# EAGLE design BSPD_revD (EAGLE 9.2.0)
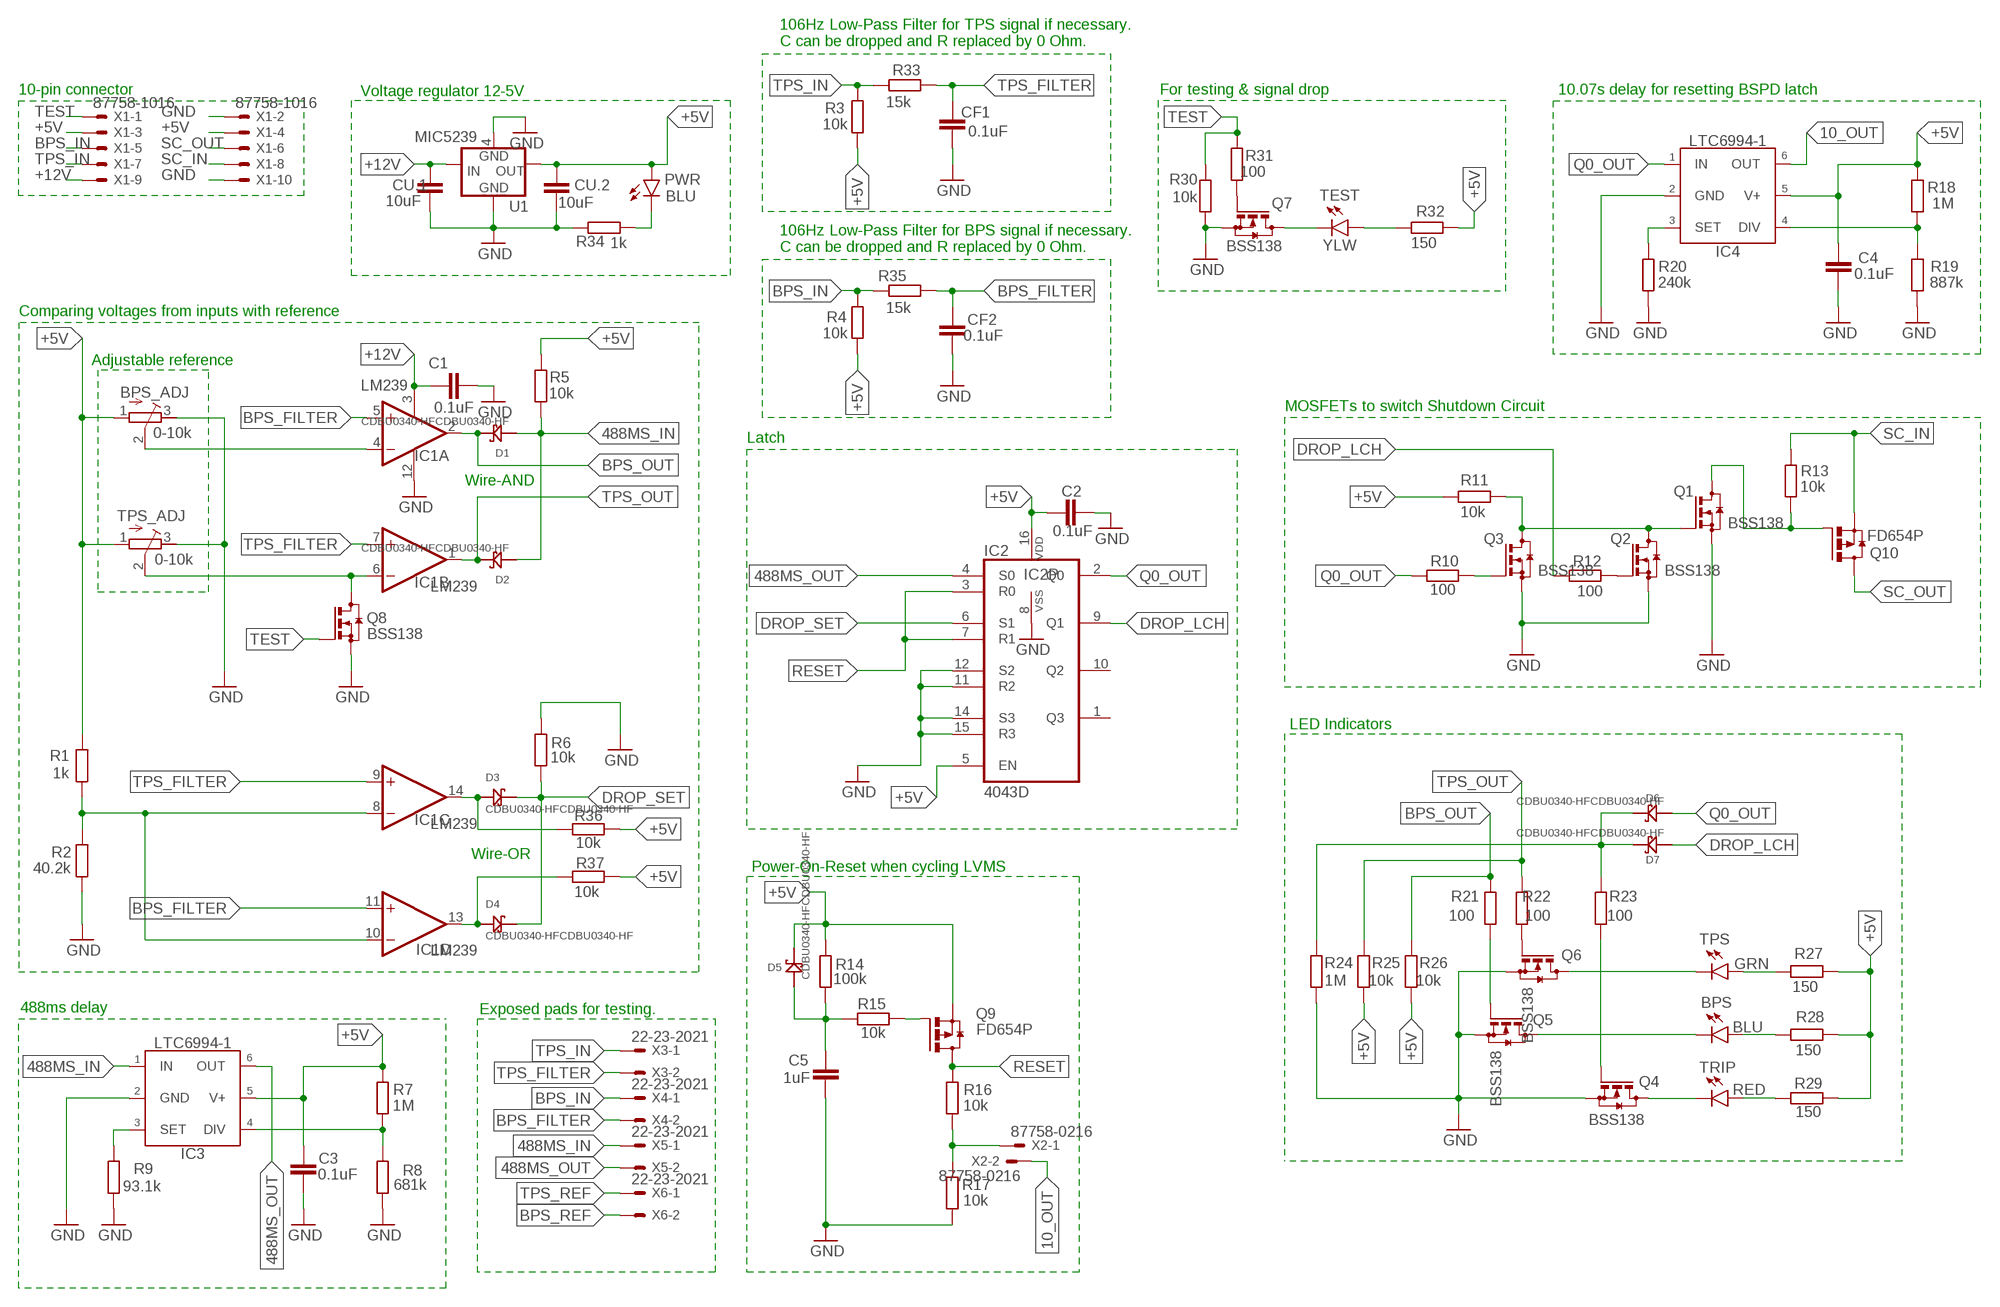
[diagram p0: schematic, sheet 1]

## Parts
BPS  BLU  LEDSML1206  [SML1206]
BPS_ADJ  0-10k  R-TRIMM3296W  [RTRIM3296W]
C1  0.1uF  C-EUC0603  [C0603]
C2  0.1uF  C-EUC0603  [C0603]
C3  0.1uF  C-EUC0603  [C0603]
C4  0.1uF  C-EUC0603  [C0603]
C5  1uF  C-EUC0603  [C0603]
CF1  0.1uF  C-EUC0603  [C0603]
CF2  0.1uF  C-EUC0603  [C0603]
CU.1  10uF  C-EUC0603  [C0603]
CU.2  10uF  C-EUC0603  [C0603]
D1  CDBU0340-HFCDBU0340-HF  [DIOM1709X85]
D2  CDBU0340-HFCDBU0340-HF  [DIOM1709X85]
D3  CDBU0340-HFCDBU0340-HF  [DIOM1709X85]
D4  CDBU0340-HFCDBU0340-HF  [DIOM1709X85]
D5  CDBU0340-HFCDBU0340-HF  [DIOM1709X85]
D6  CDBU0340-HFCDBU0340-HF  [DIOM1709X85]
D7  CDBU0340-HFCDBU0340-HF  [DIOM1709X85]
IC1  LM239  LM2901D  [SO14]
IC2  4043D  [SO16]
IC3  LTC6994-1  [TSOT23-6]
IC4  LTC6994-1  [TSOT23-6]
PWR  BLU  LEDSML1206  [SML1206]
Q1  BSS138  BSS123  [SOT23]
Q2  BSS138  BSS123  [SOT23]
Q3  BSS138  BSS123  [SOT23]
Q4  BSS138  BSS123  [SOT23]
Q5  BSS138  BSS123  [SOT23]
Q6  BSS138  BSS123  [SOT23]
Q7  BSS138  BSS123  [SOT23]
Q8  BSS138  BSS123  [SOT23]
Q9  FD654P  [SOT-23-6]
Q10  FD654P  [SOT-23-6]
R1  1k  R-EU_R0603  [R0603]
R2  40.2k  R-EU_R0603  [R0603]
R3  10k  R-EU_R0603  [R0603]
R4  10k  R-EU_R0603  [R0603]
R5  10k  R-EU_R0603  [R0603]
R6  10k  R-EU_R0603  [R0603]
R7  1M  R-EU_R0603  [R0603]
R8  681k  R-EU_R0603  [R0603]
R9  93.1k  R-EU_R0603  [R0603]
R10  100  R-EU_R0603  [R0603]
R11  10k  R-EU_R0603  [R0603]
R12  100  R-EU_R0603  [R0603]
R13  10k  R-EU_R0603  [R0603]
R14  100k  R-EU_R0603  [R0603]
R15  10k  R-EU_R0603  [R0603]
R16  10k  R-EU_R0603  [R0603]
R17  10k  R-EU_R0603  [R0603]
R18  1M  R-EU_R0603  [R0603]
R19  887k  R-EU_R0603  [R0603]
R20  240k  R-EU_R0603  [R0603]
R21  100  R-EU_R0603  [R0603]
R22  100  R-EU_R0603  [R0603]
R23  100  R-EU_R0603  [R0603]
R24  1M  R-EU_R0603  [R0603]
R25  10k  R-EU_R0603  [R0603]
R26  10k  R-EU_R0603  [R0603]
R27  150  R-EU_R0603  [R0603]
R28  150  R-EU_R0603  [R0603]
R29  150  R-EU_R0603  [R0603]
R30  10k  R-EU_R0603  [R0603]
R31  100  R-EU_R0603  [R0603]
R32  150  R-EU_R0603  [R0603]
R33  15k  R-EU_R0603  [R0603]
R34  1k  R-EU_R0603  [R0603]
R35  15k  R-EU_R0603  [R0603]
R36  10k  R-EU_R0603  [R0603]
R37  10k  R-EU_R0603  [R0603]
TEST  YLW  LEDSML1206  [SML1206]
TPS  GRN  LEDSML1206  [SML1206]
TPS_ADJ  0-10k  R-TRIMM3296W  [RTRIM3296W]
TRIP  RED  LEDSML1206  [SML1206]
U1  MIC5239  [SOT223]
X1  87758-1016  [87758-1016]
X2  87758-0216  [87758-0216]
X3  22-23-2021  [22-23-2021]
X4  22-23-2021  [22-23-2021]
X5  22-23-2021  [22-23-2021]
X6  22-23-2021  [22-23-2021]

## Nets
10_OUT: IC4.6(OUT) X2.2
488MS_IN: D1.2$A(A) D2.2$A(A) IC3.1(IN) R5.1 X5.1
488MS_OUT [Min]: IC2.4(S0) IC3.6(OUT) X5.2
+5V: BPS_ADJ.1(A) C2.1 C3.2 C4.2 CU.2.1 D5.1$K(K) IC2.5(EN) IC2.16(VDD) IC3.5(V+) IC4.5(V+) PWR.A Q9.4(S) R1.2 R3.1 R4.1 R5.2 R7.2 R11.2 R14.2 R18.2 R25.1 R26.1 R27.2 R28.2 R29.2 R32.2 R36.1 R37.1 TPS_ADJ.1(A) U1.3(OUT) X1.3 X1.4
+12V: C1.1 CU.1.1 IC1.3(P:V+) U1.1(IN) X1.9
BPS_DROP: D4.2$A(A) IC1.13(D:OUT) R37.2
BPS_FILTER: CF2.2 IC1.5(A:+IN) IC1.11(D:+IN) R35.1 X4.2
BPS_IN: R4.2 R35.2 X1.5 X4.1
BPS_OUT: D1.1$K(K) IC1.2(A:OUT) R21.2 R26.2
BPS_REF: BPS_ADJ.2(S) IC1.4(A:-IN) X6.2
DROP_LCH: D7.2$A(A) IC2.9(Q1) R12.2
DROP_SET: D3.1$K(K) D4.1$K(K) IC2.6(S1) R6.1
GND: BPS_ADJ.3(E) C1.2 C2.2 C3.1 C4.1 C5.1 CF1.1 CF2.1 CU.1.2 CU.2.2 IC1.12(P:V-) IC2.8(VSS) IC2.11(R2) IC2.12(S2) IC2.14(S3) IC2.15(R3) IC3.2(GND) IC4.2(GND) Q1.2(S) Q2.2(S) Q3.2(S) Q4.2(S) Q5.2(S) Q6.2(S) Q7.2(S) Q8.2(S) R2.1 R6.2 R8.1 R9.1 R17.2 R19.1 R20.1 R24.1 R30.1 R34.1 TPS_ADJ.3(E) U1.2(GND) U1.4(GND_TAB) X1.2 X1.10
LED_DROP: Q7.3(D) TEST.C
N$1: R16.2 R17.1 X2.1
N$2: Q1.3(D) Q10.3(G) R13.2
N$5: IC1.8(C:-IN) IC1.10(D:-IN) R1.1 R2.2
N$9: IC3.4(DIV) R7.1 R8.2
N$10: Q1.1(G) Q2.3(D) Q3.3(D) R11.1
N$11: R27.1 TPS.A
N$12: BPS.A R28.1
N$13: BPS.C Q5.3(D)
N$14: Q6.3(D) TPS.C
N$15: R29.1 TRIP.A
N$16: Q4.3(D) TRIP.C
N$17: Q2.1(G) R12.1
N$18: C5.2 D5.2$A(A) R14.1 R15.2
N$19: PWR.C R34.2
N$24: Q5.1(G) R21.1
N$25: Q6.1(G) R22.1
N$27: Q4.1(G) R23.1
N$28: R32.1 TEST.A
N$31: IC4.4(DIV) R18.1 R19.2
N$32: IC4.3(SET) R20.2
N$33: Q3.1(G) R10.2
N$36: Q7.1(G) R31.1
N$38: IC3.3(SET) R9.2
N$40: D6.1$K(K) D7.1$K(K) R23.2 R24.2
N$41: Q9.3(G) R15.1
Q0_OUT: D6.2$A(A) IC2.2(Q0) IC4.1(IN) R10.1
RESET: IC2.3(R0) IC2.7(R1) Q9.1(D) Q9.2(D) Q9.5(D) Q9.6(D) R16.1
SC_IN: Q10.4(S) R13.1 X1.8
SC_OUT: Q10.1(D) Q10.2(D) Q10.5(D) Q10.6(D) X1.6
TEST: Q8.1(G) R30.2 R31.2 X1.1
TPS_DROP: D3.2$A(A) IC1.14(C:OUT) R36.2
TPS_FILTER: CF1.2 IC1.7(B:+IN) IC1.9(C:+IN) R33.1 X3.2
TPS_IN: R3.2 R33.2 X1.7 X3.1
TPS_OUT: D2.1$K(K) IC1.1(B:OUT) R22.2 R25.2
TPS_REF: IC1.6(B:-IN) Q8.3(D) TPS_ADJ.2(S) X6.1
Unconnected: IC2.1(Q3) IC2.10(Q2)

## Notes on the sheet
- 106Hz Low-Pass Filter for TPS signal if necessary.
  C can be dropped and R replaced by 0 Ohm.
- 10-pin connector | Voltage regulator 12-5V | For testing & signal drop | 10.07s delay for resetting BSPD latch
- 106Hz Low-Pass Filter for BPS signal if necessary.
  C can be dropped and R replaced by 0 Ohm.
- Comparing voltages from inputs with reference
- Adjustable reference
- MOSFETs to switch Shutdown Circuit
- Latch
- Wire-AND
- LED Indicators
- Wire-OR
- Power-On-Reset when cycling LVMS
- 488ms delay | Exposed pads for testing.

## Library data of the parts
BPS PWR TEST TPS TRIP = led:LED: LED OSRAM: - CHIPLED LG R971, LG N971, LY N971, LG Q971, LY Q971, LO R971, LY R971 LH N974, LH R974 LS Q976, LO Q976, LY Q976 LO Q996 - Hyper CHIPLED LW Q18S LB Q993, LB Q99A, LB R99A - SideLED LS A670, LO A670, LY A670, LG A670, LP A670 LB A673, LV A673, LT A673, LW A673 LH A674 LY A675 LS A676, LA A676, LO A676, LY A676, LW A676 LS A679, LY A679, LG A679 - Hyper Micro SIDELED® LS Y876, LA Y876, LO Y876, LY Y876 LT Y87S - SmartLED LW L88C, LW L88S LB L89C, LB L89S, LG L890 LS L89K, LO L89K, LY L89K LS L896, LA L896, LO L896, LY L896 - TOPLED LS T670, LO T670, LY T670, LG T670, LP T670 LSG T670, LSP T670, LSY T670, LOP T670, LYG T670 LG T671, LOG T671, LSG T671 LB T673, LV T673, LT T673, LW T673 LH T674 LS T676, LA T676, LO T676, LY T676, LB T676, LH T676, LSB T676, LW T676 LB T67C, LV T67C, LT T67C, LS T67K, LO T67K, LY T67K, LW E67C LS E67B, LA E67B, LO E67B, LY E67B, LB E67C, LV E67C, LT E67C LW T67C LS T679, LY T679, LG T679 LS T770, LO T770, LY T770, LG T770, LP T770 LB T773, LV T773, LT T773, LW T773 LH T774 LS E675, LA E675, LY E675, LS T675 LS T776, LA T776, LO T776, LY T776, LB T776 LHGB T686 LT T68C, LB T68C - Hyper Mini TOPLED® LB M676 - Mini TOPLED Santana® LG M470 LS M47K, LO M47K, LY M47K Source: http://www.osram.convergy.de LUXEON: - LUMILED® LXK2-PW12-R00, LXK2-PW12-S00, LXK2-PW14-U00, LXK2-PW14-V00 LXK2-PM12-R00, LXK2-PM12-S00, LXK2-PM14-U00 LXK2-PE12-Q00, LXK2-PE12-R00, LXK2-PE12-S00, LXK2-PE14-T00, LXK2-PE14-U00 LXK2-PB12-K00, LXK2-PB12-L00, LXK2-PB12-M00, LXK2-PB14-N00, LXK2-PB14-P00, LXK2-PB14-Q00 LXK2-PR12-L00, LXK2-PR12-M00, LXK2-PR14-Q00, LXK2-PR14-R00 LXK2-PD12-Q00, LXK2-PD12-R00, LXK2-PD12-S00 LXK2-PH12-R00, LXK2-PH12-S00 LXK2-PL12-P00, LXK2-PL12-Q00, LXK2-PL12-R00 Source: www.luxeon.com KINGBRIGHT: KA-3528ASYC Source: www.kingbright.com
BPS_ADJ TPS_ADJ = rcl:R-TRIMM: Trimm resistor; SPICEMODEL: X; SPICEPREFIXL: POT
C1-C5 CF1 CF2 CU.1 CU.2 = rcl:C-EU: CAPACITOR, European symbol; SPICEPREFIX: C
D1-D7 = BSPD:CDBU0340-HF
IC1 = linear:LM2901: COMPARATOR
IC2 = 40xx:4043: Quad 3-state NOR R/S LATCH
IC3 IC4 = div1:LTC6994-1: TimerBlox Retriggerable One Edge Delay; SPICEMODEL: LTC6994-1.sub; VALUE2: LTC6994-1
Q1-Q8 = transistor-small-signal:BSS123: N-CHANNEL MOS FET
Q9 Q10 = BSPD:FD654P
R1-R37 = rcl:R-EU_: RESISTOR, European symbol; SPICEPREFIX: R
U1 = BSPD:MIC5239
X1 = con-molex:87758-1016: 10 Pin - 2mm Dual Row Single Wafer, Vertical T/H HDR Source: http://www.molex.com/pdm_docs/sd/877580616_sd.pdf; MF: MOLEX; MPN: 87758-1016; OC_FARNELL: 7472340; OC_NEWARK: 59J1558
X2 = con-molex:87758-0216: 2 Pin - 2mm Dual Row Single Wafer, Vertical T/H HDR Source: http://www.molex.com/pdm_docs/sd/877580616_sd.pdf; MF: MOLEX; MPN: 87758-0216; OC_FARNELL: unknown; OC_NEWARK: 94M1513
X3-X6 = con-molex:22-23-2021: .100" (2.54mm) Center Header - 2 Pin; MF: MOLEX; MPN: 22-23-2021; OC_FARNELL: 1462926; OC_NEWARK: 25C3832

## Net classes
0 default: width 0.381 mm, drill 0.254 mm, clearance 0.127 mm
1 PWR: width 0.762 mm, drill 0.254 mm, clearance 0.127 mm
2 GND: width 0.762 mm, drill 0.254 mm, clearance 0.127 mm
3 Min: width 0.152 mm, drill 0.254 mm, clearance 0.127 mm

## Board
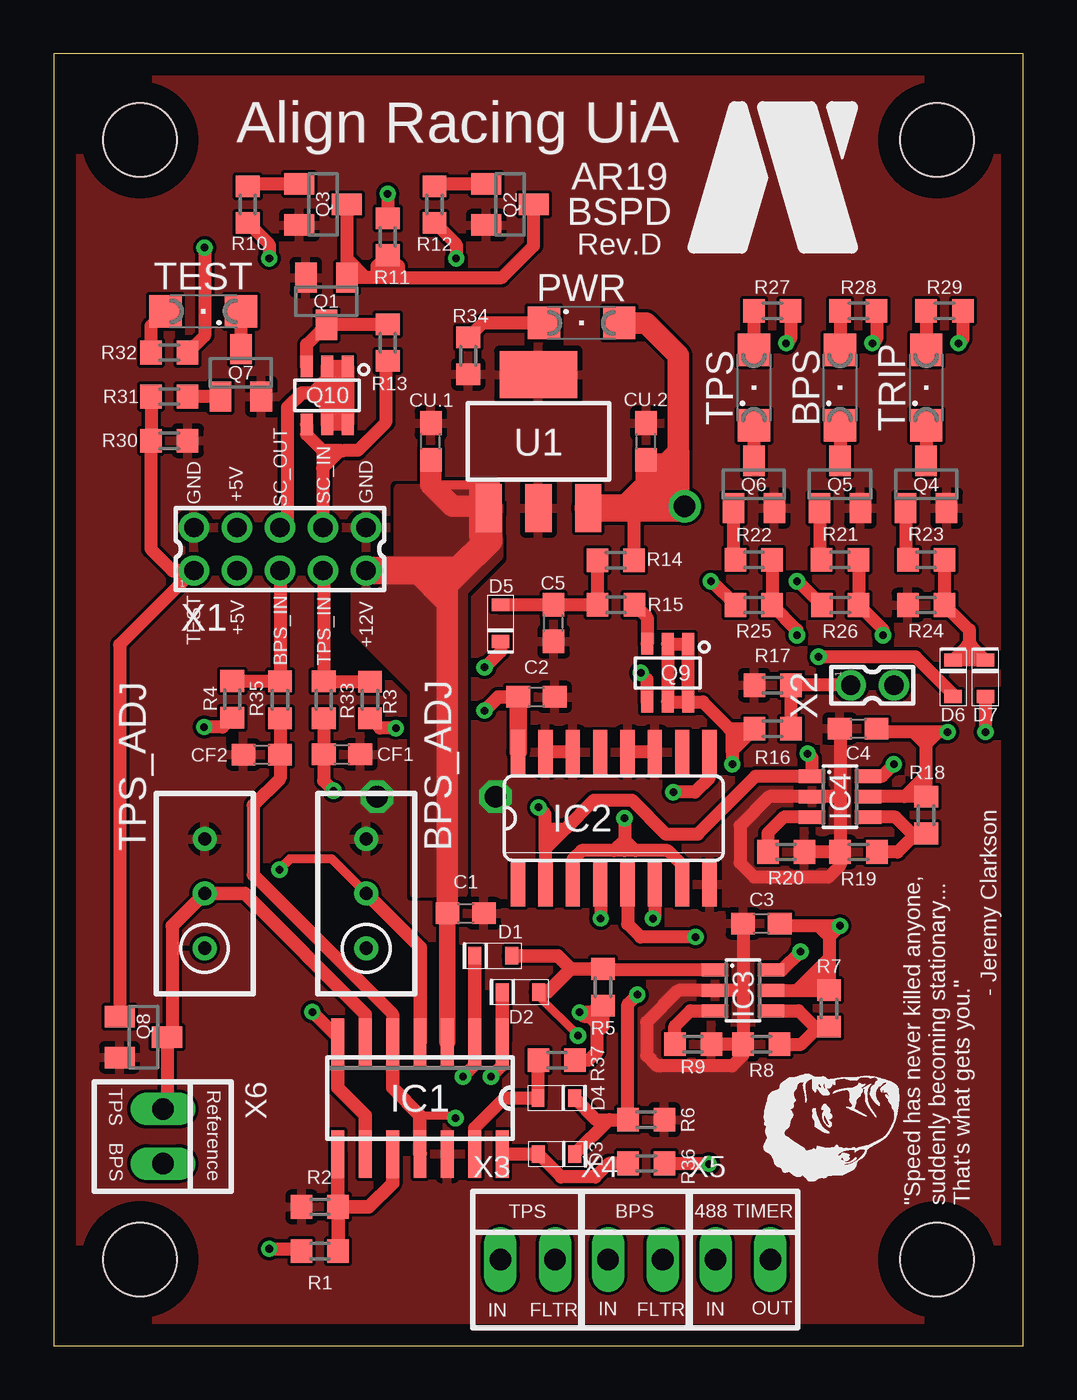
[diagram p1: board, top side]
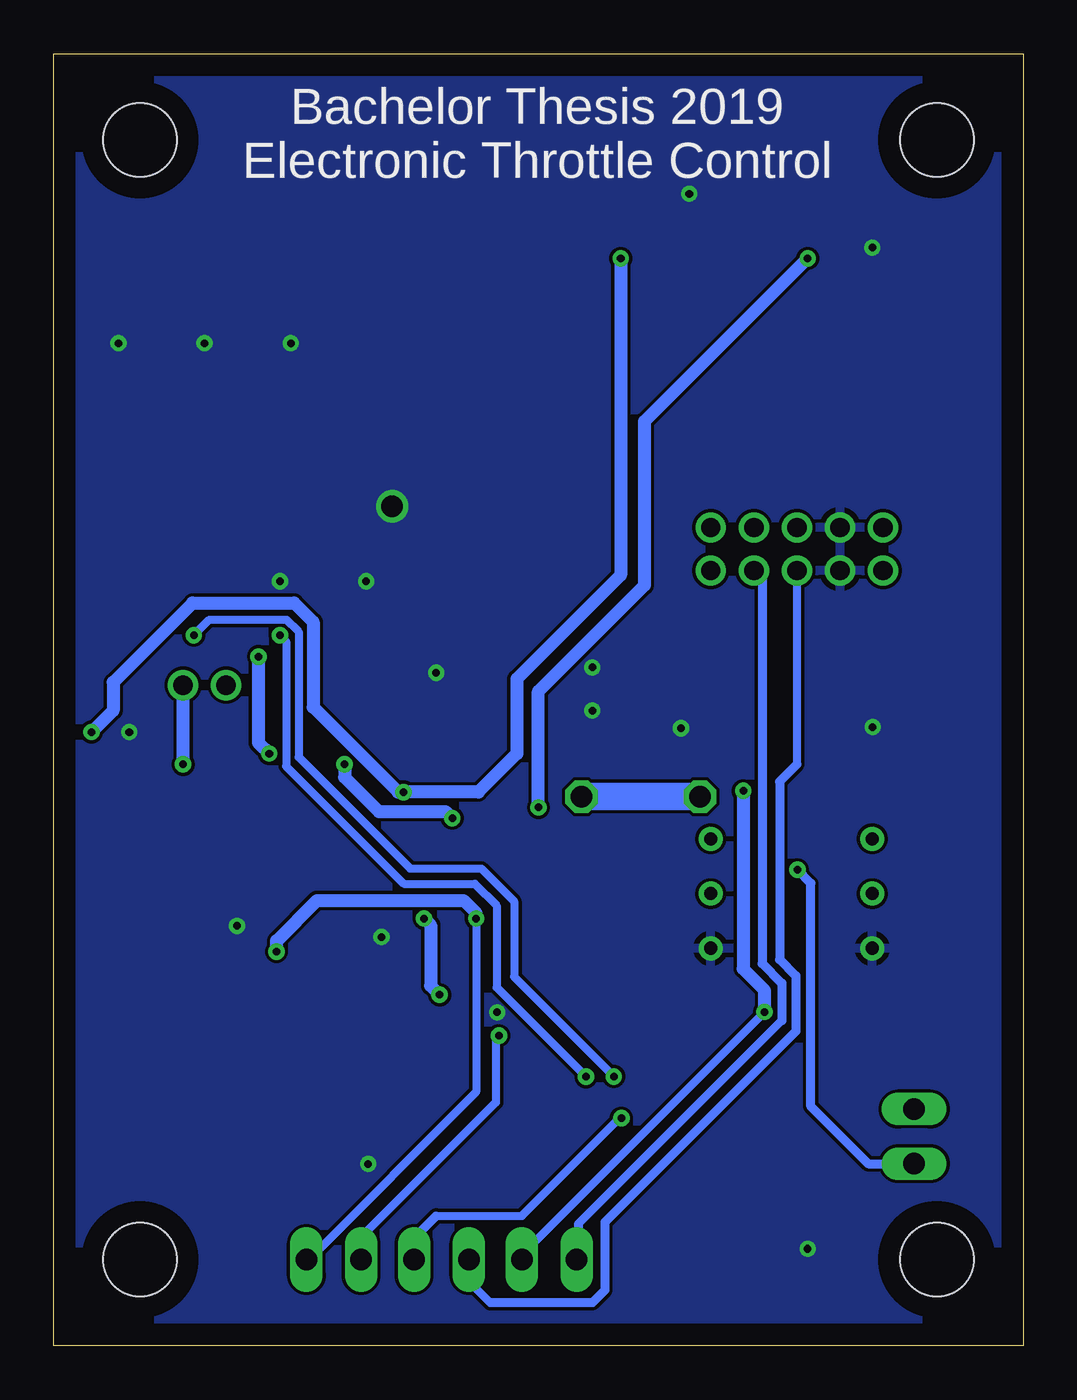
[diagram p2: board, bottom side, seen from below]

Size 45 x 60 mm. Coordinates in mm from the lower left corner, seen from the top.
Outline: 0,0 45,0 45,60 0,60 0,0
Copper layers (1*16): Top 0.035mm / dielectric 1.5mm / Bottom 0.035mm
Design rules "default": minimum track width 6mil, minimum drill 0.35mm, track to track 6mil, track to pad 6mil, pad to pad 6mil, via to via 6mil, smd to smd 6mil, copper to edge 40mil, drill to drill 6mil, minimum pad ring 10mil, minimum via ring 8mil, stop-mask expansion 4mil, vias tented up to drill 0mil, thermal gap 10mil
Holes 3.4 mm at 4,4 4,56 41,56 41,4

### Footprints (pad centres in the part's own frame; a part is rotated, then mirrored left to right if it is on the bottom)
SML1206 = smd 1.5 x 1.5: A 1.75,0; C -1.75,0
RTRIM3296W = drill 0.61: 1 0,-2.54; 2 0,0; 3 0,2.54
C0603 = smd 1.1 x 1: 1 -0.85,0; 2 0.85,0
DIOM1709X85 = smd 0.6 x 0.8: 1$K -0.85,0; 2$A 0.85,0
SO14 = smd 0.6 x 2.2: 1 -3.81,-2.6; 2 -2.54,-2.6; 3 -1.27,-2.6; 4 0,-2.6; 5 1.27,-2.6; 6 2.54,-2.6; 7 3.81,-2.6; 8 3.81,2.6; 9 2.54,2.6; 10 1.27,2.6; 11 0,2.6; 12 -1.27,2.6; 13 -2.54,2.6; 14 -3.81,2.6
SO16 = smd 0.66 x 2.032: 1 -4.445,-3.073; 2 -3.175,-3.073; 3 -1.905,-3.073; 4 -0.635,-3.073; 5 0.635,-3.073; 6 1.905,-3.073; 7 3.175,-3.073; 8 4.445,-3.073; 9 4.445,3.073; 10 3.175,3.073; 11 1.905,3.073; 12 0.635,3.073; 13 -0.635,3.073; 14 -1.905,3.073; 15 -3.175,3.073; 16 -4.445,3.073
TSOT23-6 = smd 0.62 x 1.22: 1 -0.95,-1.3; 2 0,-1.3; 3 0.95,-1.3; 4 0.95,1.3; 5 0,1.3; 6 -0.95,1.3
SOT23 = smd 1 x 1.4: 1 -0.95,-1.1; 2 0.95,-1.1; 3 0,1.1
SOT-23-6 = smd 1 x 0.55: 1 -1.35,0.95; 2 -1.35,0; 3 -1.35,-0.95; 4 1.35,-0.95; 5 1.35,0; 6 1.35,0.95
R0603 = smd 1 x 1.1: 1 -0.85,0; 2 0.85,0
SOT223 = smd 1.219 x 2.235: 1 -2.311,-3.099; 2 0,-3.099; 3 2.311,-3.099 | smd 3.6 x 2.2: 4 0,3.099
87758-1016 = drill 0.9 pad 1.27: 1 -4,-1; 2 -4,1; 3 -2,-1; 4 -2,1; 5 0,-1; 6 0,1; 7 2,-1; 8 2,1; 9 4,-1; 10 4,1
87758-0216 = drill 0.9 pad 1.27: 1 0,-1; 2 0,1
22-23-2021 = drill 1 long: 1 -1.27,0; 2 1.27,0

### Placement (x,y rotation side)
BPS  36.5,44.5 90 top
BPS_ADJ  14.5,21 0 top
C1  19.12,20.08 0 top
C2  22.41,30.13 0 top
C3  32.85,19.61 0 top
C4  37.34,28.66 0 top
C5  23.2,33.56 90 top
CF1  13.38,27.46 180 top
CF2  9.65,27.45 0 top
CU.1  17.5,42 90 top
CU.2  27.5,42 90 top
D1  20.4,18.11 0 top
D2  21.66,16.42 0 top
D3  23.34,8.9 180 top
D4  23.33,11.5 180 top
D5  20.74,33.56 90 top
D6  41.75,31 270 top
D7  43.25,31 270 top
IC1  17,11.5 180 top
IC2  26,24.5 0 top
IC3  32,16.5 270 top
IC4  36.5,25.5 270 top
PWR  24.5,47.5 0 top
Q1  12.65,48.51 180 top
Q2  21.18,53 270 top
Q3  12.5,53 270 top
Q4  40.5,40 0 top
Q5  36.5,40 0 top
Q6  32.5,40 0 top
Q7  8.68,45.19 0 top
Q8  4.16,14.33 270 top
Q9  28.5,31.25 270 top
Q10  12.69,44.14 270 top
R1  12.35,4.4 180 top
R2  12.35,6.45 0 top
R3  14.69,30 90 top
R4  8.28,30.02 90 top
R5  25.5,16.65 270 top
R6  27.5,10.5 0 top
R7  35.99,15.66 90 top
R8  32.85,14 0 top
R9  29.68,14 180 top
R10  9,53 90 top
R11  15.5,51.5 90 top
R12  17.68,53 270 top
R13  15.5,46.58 90 top
R14  26.09,36.47 0 top
R15  26.1,34.41 180 top
R16  33.37,28.65 0 top
R17  33.37,30.68 180 top
R18  40.5,24.64 90 top
R19  37.36,22.93 0 top
R20  34,22.93 180 top
R21  36.5,36.5 0 top
R22  32.5,36.5 0 top
R23  40.5,36.5 0 top
R24  40.5,34.4 0 top
R25  32.5,34.4 0 top
R26  36.51,34.4 0 top
R27  33.36,48.06 0 top
R28  37.35,48.06 0 top
R29  41.35,48.06 0 top
R30  5.36,42.03 180 top
R31  5.36,44.08 180 top
R32  5.36,46.12 0 top
R33  12.53,30 90 top
R34  19.24,45.97 90 top
R35  10.5,30 90 top
R36  27.51,8.47 180 top
R37  23.35,13.26 180 top
TEST  6.94,48.04 180 top
TPS  32.5,44.5 90 top
TPS_ADJ  7,21 0 top
TRIP  40.5,44.5 90 top
U1  22.5,42 0 top
X1  10.5,37 0 top
X2  38,30.68 270 top
X3  22,4 0 top
X4  27,4 0 top
X5  32,4 0 top
X6  5.06,9.72 270 top

### Tracks (layer width: path | path; a pad name or v marks a point on that pad's centre or on a via)
10_OUT  (via drill 0.35)
  Top 0.61: v39,27 38.45,26.45 IC4.6
  Bottom 0.61: v39,27 X2.2
488MS_IN  (via drill 0.35)
  Top 0.381: D2.2$A 22.51,16.23 v24.34,14.4
  Top 0.61: IC3.1 25.55,17.45 R5.1
  Top 0.635: D2.2$A 22.92,16.42 24,17.5 | D1.2$A 23.39,18.11 24,17.5 | R5.1 24,17.5
  Bottom 0.381: v24.34,14.4 24.48,14.26 24.48,11.3 30.73,5.05 X5.1
488MS_OUT  (via drill 0.35)
  Top 0.61: IC3.6 33.8,17.45 v34.65,18.3 v34.66,18.3 | IC2.4 25.39,21.4 v25.39,19.84
  Bottom 0.381: v25.39,19.84 25.39,11.78 33.17,4 X5.2
  Bottom 0.61: v25.39,19.84 25.39,20.09 25.97,20.68 32.78,20.68 34.66,18.8 v34.66,18.3
+5V  (via drill 0.35, 1)
  Top 0.61: v29.79,18.98 27.24,18.98 26.64,19.59 IC2.5 | v10,4.5 11.4,4.5 R1.2 | R4.1 7.84,28.73 v6.99,28.73 v6.98,28.73 | R5.2 25.31,15.8 24.99,15.48 v24.41,15.48 24.6,15.3 24.85,15.3 25.21,14.94 | 39.5,25.5 IC4.5 | R18.2 39.5,25.5 | R18.2 | C4.2 38.35,28.5 39.91,28.5 | 40.5,28.5 v41.5,28.5 41.07,28.5 40.49,27.92 39.91,28.5 | 40.5,28.5 39.91,28.5 | 40.49,26.49 40.49,28.49 40.5,28.5 | 40.49,26.49 R18.2 | 40.49,26.49 39.5,25.5 | v15.5,53.5 R11.2 | R14.2 26.94,38.56 26.5,39 | D5.1$K 20.74,32.24 v20,31.5 | 35.48,19.5 v36.5,19.5 35.99,18.99 | 35.48,19.5 33.81,19.5 C3.2 | 35.99,18.99 35.99,18 | 35.99,18 35.99,17.5 | 35.99,17.5 R7.2 35,16.51 | 35.99,18.99 35.48,19.5 | IC3.5 34.5,16.51 | 34.5,16.51 35,16.51 | 34.5,16.51 35.99,18 | 35,16.51 35.99,17.5 | CU.2.1 28.65,41.15 29,41.5 | R27.2 34.21,46.77 v34,46.56 | R28.2 38.2,46.76 v38,46.56 | R29.2 42.2,46.76 v42,46.56 | v7,51 7,46.91 R32.2 | v34.5,35.5 34.56,35.5 R26.1 | v30.5,35.5 30.55,35.5 R25.1 | Q9.4 27.55,30.95 v27.25,31.25 | v30.41,8.44 28.38,8.44 R36.1 | 25.21,14.94 25.21,14.53 | 25.21,14.53 25.21,13.64 24.82,13.25 24.21,13.25 R37.1 | R5.2 25.21,15.51 25.21,14.94 | 25.21,14.53 25.5,14.82 R5.2 | v15.88,28.68 15.15,28.68 R3.1
  Top 0.635: v20,29.5 20.63,30.13 C2.1
  Top 0.813: C2.1 IC2.16
  Top 1: U1.3 24.91,39 26.5,39 27.5,40 | CU.2.1 27.5,40 | 27.5,40 29,41.5 29,46 27.5,47.5 PWR.A
  Top 1.016: 29,41.5 29,39.1 29.2,38.9 | v29.29,38.99 28.28,40 27.5,40
  Top 1.27: U1.3 29.2,38.9 v29.29,38.99
  pour Bottom (rank 2): -1,61 46,61 46,-1 -1,-1
+12V
  Top 0.406: 17.5,40 19.5,40 | 19.5,40 20.5,40 20.5,38.5 19.5,37.5 19.5,40
  Top 0.762: C1.1 IC1.3
  Top 1: U1.1 20.09,39 18.5,39 17.5,40 CU.1.1 | 18.27,35.48 18.27,34.5 | 18.27,34.5 C1.1 | 18.27,34.5 16.77,36 16.5,36
  Top 1.27: U1.1 20.19,37.4 18.79,36 | 18.79,36 16.5,36 X1.9 | 18.79,36 18.27,35.48
  pour Top: 16,39.83 20.65,39.83 20.65,36.65 19,35 19,21 16.75,21 16.75,30.44 14,33.19 14,36.5 16,36.5
BPS_DROP
  Top 0.61: IC1.13 19.54,10.11 20.93,11.5 D4.2$A 22.48,13.24 R37.2
BPS_FILTER  (via drill 0.35)
  Top 0.381: 17,10.7 18.52,10.7 v18.65,10.57
  Top 0.61: R35.1 CF2.2 10.5,26.35 9.26,25.11 9.26,21.88 15.73,15.41 IC1.5
  Top 0.635: IC1.11 17,10.7 15.73,11.96 IC1.5 | IC1.11
  Bottom 0.381: v18.65,10.57 18.72,10.57 23.27,6.02 27.25,6.02
  Bottom 0.406: X4.2 28.27,5 27.25,6.02
BPS_IN
  Top 0.61: X1.5 R35.2 10.48,30.87 R4.2
  Bottom 0.381: X1.5 10.5,27 | 25.73,3 24.73,2
  Bottom 0.406: 10.5,27 11.3,26.2 11.3,17.93 10.55,17.18 10.55,14.6 19.42,5.74 19.42,2.58 20,2 24.73,2 | X4.1 25.73,3
BPS_OUT  (via drill 0.35)
  Top 0.61: R21.2 R26.2 38.5,33.26 v38.5,33 | IC1.2 19.54,13.04 v19,12.5
  Top 0.635: IC1.2 D1.1$K
  Bottom 0.381: v19,12.5 23.64,17.14 23.64,20.64 25.16,22.16 28.46,22.16 33.64,27.34 33.64,33.16 34.2,33.72 37.78,33.72 v38.5,33
BPS_REF  (via drill 0.35)
  Top 0.406: BPS_ADJ.2 12.89,22.61 10.98,22.61 v10.48,22.11
  Top 0.635: BPS_ADJ.2 17,18.5 IC1.4
  Bottom 0.406: v10.48,22.11 9.85,21.48 9.85,11.11 7.19,8.45 X6.2
DROP_LCH  (via drill 0.35)
  Top 0.61: IC2.9 30.45,26.39 29.76,25.71 v28.76,25.71 | R12.2 18.68,51.15 v18.68,50.5 | D7.2$A v43.25,28.5
  Bottom 0.61: v18.68,50.5 18.68,35.79 23.5,30.97 23.5,27.5 25.29,25.71 v28.76,25.71 29.01,25.71 32.96,29.66 32.96,33.61 33.85,34.5 38.56,34.5 42.25,30.81 42.25,29.5 v43.25,28.5
DROP_SET  (via drill 0.35)
  Top 0.61: D3.1$K 25.79,10.5 R6.1 | D4.1$K 25.18,10.5 R6.1 | IC2.6 27.91,19.93 v27.81,19.84 | R6.1 26.65,15.86 v27.09,16.3
  Bottom 0.61: v27.09,16.3 27.51,16.72 27.51,19.54 v27.81,19.84
GND  (via drill 1)
  Top 0.61: R8.1 R9.1 | 32,16.5 R8.1 | 32,16.5 IC3.2 29,16.5 27.52,15.02 27.52,13.48 28,13 28.13,13 28.14,12.99 31.49,12.99 32,13.5 R8.1 | C3.1 32,16.5 | IC2.14 IC2.15 | IC2.11 IC2.12 | C4.1 36.5,25.5 | 36.5,25.5 IC4.2 33.22,25.5 31.86,24.14 31.86,22.43 32.54,21.75 35.95,21.75 36.51,22.31 R19.1 | 36.5,25.5 R19.1 | R19.1 R20.1
  Bottom 1.27: v15,25.5 v20.5,25.5
  pour Top (rank 2): -0.5,60.5 45.5,60.5 45.5,-0.5 -0.5,-0.5
LED_DROP
  Top 0.61: Q7.3 TEST.C
N$1
  Top 0.61: X2.1 R17.1 R16.2
N$2
  Top 0.61: R13.2 12.67,47.43 Q1.3 11.74,46.5 Q10.3
N$5
  Top 0.635: IC1.8 R2.2 | R2.2 R1.1 | R2.2 14.63,6.45 15.73,7.55 IC1.10
N$9
  Top 0.61: R8.2 34.7,14 35.51,14.81 R7.1 35.32,14.81 34.58,15.55 IC3.4
N$10
  Top 0.61: Q1.1 13.6,50.5 14.49,49.61 | 16,49.61 20.81,49.61 22.28,51.08 Q2.3 | 16,49.61 15.5,49.61 | 15.5,49.61 15,49.61 | 15,49.61 14.49,49.61 | 14.49,49.61 Q1.1 | R11.1 15.5,49.61 | R11.1 15,50.15 15,49.61 | R11.1 16,50.15 16,49.61 | Q3.3 Q1.1
N$11
  Top 0.61: R27.1 TPS.A
N$12
  Top 0.61: R28.1 BPS.A
N$13
  Top 0.61: BPS.C Q5.3
N$14
  Top 0.61: TPS.C Q6.3
N$15
  Top 0.61: R29.1 TRIP.A
N$16
  Top 0.61: TRIP.C Q4.3
N$17
  Top 0.61: Q2.1 17.78,53.95 R12.1
N$18
  Top 0.61: D5.2$A C5.2 R15.2 R14.1
N$19
  Top 0.61: PWR.C 19.92,47.5 R34.2
N$24
  Top 0.61: Q5.1 35.55,36.6 R21.1
N$25
  Top 0.61: Q6.1 31.55,36.6 R22.1
N$27
  Top 0.61: Q4.1 39.55,36.6 R23.1
N$28
  Top 0.61: TEST.A 4.51,47.36 R32.1
N$31
  Top 0.61: R19.2 39.18,22.93 40.04,23.79 R18.1 39.83,23.79 39.07,24.55 IC4.4
N$32
  Top 0.61: R20.2 33.15,23.81 33.89,24.55 IC4.3
N$33
  Top 0.61: Q3.1 9.1,53.95 R10.2
N$36
  Top 0.61: R31.1 Q7.1
N$38
  Top 0.61: R9.2 28.83,14.83 29.55,15.55 IC3.3
N$40
  Top 0.61: R23.2 R24.2 42.51,33.24 42.51,32.5 | 42.51,31.85 D6.1$K 42.4,32.5 42.51,32.5 | 42.51,31.85 D7.1$K 42.6,32.5 42.51,32.5 | 42.51,32.5 42.51,31.85
N$41
  Top 0.61: R15.1 27.55,33.81 Q9.3
Q0_OUT  (via drill 0.35)
  Top 0.61: 22.81,23.07 23.74,24 | 23.74,24 25.08,25.34 26.85,25.34 28.42,23.76 29.9,23.76 32.58,26.45 IC4.1 35.2,27.3 v35,27.5 | 22.81,23.07 22.81,21.44 IC2.2 | R10.1 10,51.15 v10,50.5 | 22.81,23.07 22.81,24 | 22.81,24 22.81,24.69 v22.5,25 | 22.81,24 23.74,24 | v35.5,32 40,32 41.75,30.25 D6.2$A
  Bottom 0.61: v22.5,25 22.5,30.39 17.58,35.31 17.58,42.92 v10,50.5 | v35.5,32 35.5,28 v35,27.5
RESET  (via drill 0.35)
  Top 0.61: IC2.3 24.09,22.59 24.5,23 26,23 | 27,23 28.5,23 29.18,22.32 IC2.7 | 27,23 26.5,23 | 26.5,23 26,23 | 26.5,23 26.5,23.5 | 26.5,23.5 26,23 | v26.5,24.5 26.5,23.5 | 26.5,23.5 27,23 | R16.1 31.5,27.63 v31.5,27 | Q9.6 Q9.5 Q9.2 Q9.1 Q9.6 | Q9.6 30.13,29.9 31.38,28.65
  Top 0.635: 31.5,27.63 31.5,28.53 31.38,28.65 R16.1
  Bottom 0.61: v31.5,27 31.5,26.4 29.91,24.81 26.81,24.81 v26.5,24.5
SC_IN
  Top 0.61: R13.1 15.4,45.65 15.4,42.88 14.1,41.58 13.5,41.58 13.31,41.58 | 13.31,41.58 12.48,41.58 | Q10.4 11.74,42.32 12.48,41.58 | 12.48,41.58 12.48,40.75 | 12.48,40.75 12.48,38.02 X1.8 | 12.48,40.75 13.31,41.58
  Top 0.813: R13.1
SC_OUT
  Top 0.61: 12.69,43.56 Q10.5 13.16,42.79 | 12.69,43.56 12.69,44.25 | 12.69,44.25 12.69,44.94 | 12.69,44.94 Q10.2 13.25,45.49 | 13.25,45.49 Q10.1 Q10.6 13.16,42.79 | 12.69,44.25 12,44.25 | 12,44.25 11.5,44.25 10.84,43.59 10.84,38.34 X1.6 | 12,44.25 12.69,43.56 | 12,44.25 12.69,44.94 | 13.25,45.49 13.25,42.88 13.16,42.79
TEST
  Top 0.61: Q8.1 3.06,32.55 X1.1 5.5,36 4.5,37 4.51,37.01 R30.2 R31.2
TPS_DROP
  Top 0.61: IC1.14 D3.2$A 23.55,7.84 25.14,7.84 25.77,8.47 R36.2
TPS_FILTER  (via drill 0.35)
  Top 0.61: R33.1 CF1.2 12.53,26.23 v12.99,25.77 | v12,15.5 13.19,14.31 IC1.7
  Top 0.635: IC1.9 14.46,10.7 13.19,11.96 IC1.7 | IC1.9
  Bottom 0.381: v12,15.5 23.27,4.23 X3.2
  Bottom 0.61: v12,15.5 12,16.5 13,17.5 v13,25.76 v12.99,25.77
TPS_IN
  Top 0.61: X1.7 12.53,35.97 R33.2 R3.2
  Bottom 0.381: 20.65,5.65 11.2,15.11
  Bottom 0.406: X1.7 12.11,35.61 12.11,17.75 11.2,16.83 11.2,15.11 | 20.65,5.65 20.65,4.08 X3.1
TPS_OUT  (via drill 0.35)
  Top 0.61: R22.2 R25.2 34.5,33.25 v34.5,33 | IC1.1 20.81,13.01 v20.29,12.49
  Top 0.635: D2.1$K IC1.1
  Bottom 0.381: v34.5,33 34.21,32.71 34.21,26.91 28.75,21.45 25.46,21.45 24.44,20.44 24.44,16.64 v20.29,12.49
TPS_REF
  Top 0.61: 5.5,19.5 5.5,14.57 Q8.3 5.25,11.19 X6.1
  Top 0.635: IC1.6 14.46,15.39 8.86,21 TPS_ADJ.2 5.5,19.5 | IC1.6

### Text on the board
tPlace: Align Racing UiA | AR19 | BSPD | Rev.D | SC_OUT | GND | +5V | SC_IN | GND | TEST | +5V | +12V | BPS_IN | TPS_IN | - Jeremy Clarkson | TPS | Reference | BPS | "Speed has never killed anyone, / suddenly becoming stationary... / That's what gets you." | TPS | BPS | 488 TIMER | IN | FLTR | IN | FLTR | IN | OUT
bPlace: Bachelor Thesis 2019 / Electronic Throttle Control